# Altium schematic sheet BRAKELED.SchDoc
size A4; SheetNumber: 1; SheetTotal: 1
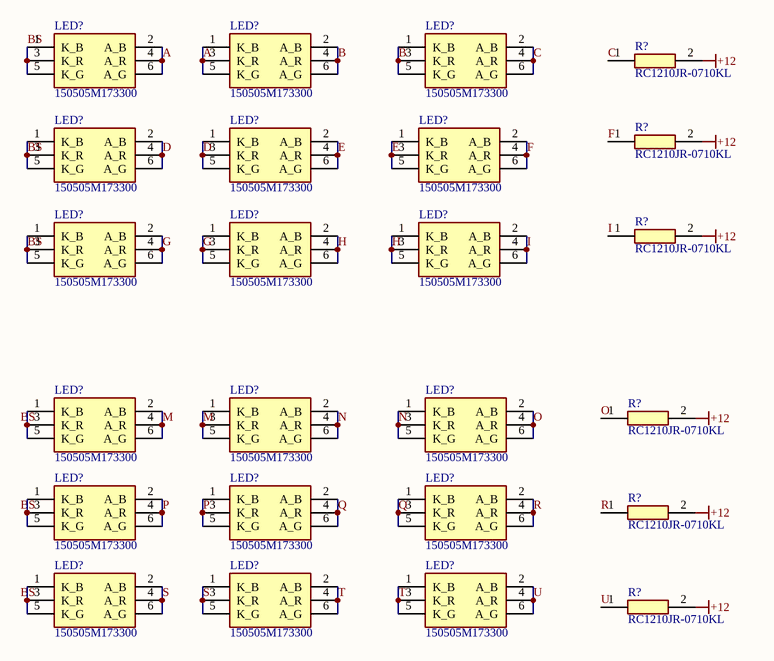
[diagram p0: BRAKELED.SchDoc]

## Parts
(Parts that share a designator on the sheet are numbered #1, #2 ... from top to bottom, then left to right.)
LED?#1  150505M173300  [150505M173300]
LED?#2  150505M173300  [150505M173300]
LED?#3  150505M173300  [150505M173300]
LED?#4  150505M173300  [150505M173300]
LED?#5  150505M173300  [150505M173300]
LED?#6  150505M173300  [150505M173300]
LED?#7  150505M173300  [150505M173300]
LED?#8  150505M173300  [150505M173300]
LED?#9  150505M173300  [150505M173300]
LED?#10  150505M173300  [150505M173300]
LED?#11  150505M173300  [150505M173300]
LED?#12  150505M173300  [150505M173300]
LED?#13  150505M173300  [150505M173300]
LED?#14  150505M173300  [150505M173300]
LED?#15  150505M173300  [150505M173300]
LED?#16  150505M173300  [150505M173300]
LED?#17  150505M173300  [150505M173300]
LED?#18  150505M173300  [150505M173300]
R?#1  RC1210JR-0710KL  [RESC3126X60N]
R?#2  RC1210JR-0710KL  [RESC3126X60N]
R?#3  RC1210JR-0710KL  [RESC3126X60N]
R?#4  RC1210JR-0710KL  [RESC3126X60N]
R?#5  RC1210JR-0710KL  [RESC3126X60N]
R?#6  RC1210JR-0710KL  [RESC3126X60N]

## Nets
+12: R?#1.2 R?#2.2 R?#3.2 R?#4.2 R?#5.2 R?#6.2
A: LED?#1.2(A_B) LED?#1.4(A_R) LED?#1.6(A_G) LED?#2.1(K_B) LED?#2.3(K_R) LED?#2.5(K_G)
B: LED?#2.2(A_B) LED?#2.4(A_R) LED?#2.6(A_G) LED?#3.1(K_B) LED?#3.3(K_R) LED?#3.5(K_G)
BS: LED?#1.1(K_B) LED?#1.3(K_R) LED?#1.5(K_G) LED?#4.1(K_B) LED?#4.3(K_R) LED?#4.5(K_G) LED?#7.1(K_B) LED?#7.3(K_R) LED?#7.5(K_G)
C: LED?#3.2(A_B) LED?#3.4(A_R) LED?#3.6(A_G) R?#1.1
D: LED?#4.2(A_B) LED?#4.4(A_R) LED?#4.6(A_G) LED?#5.1(K_B) LED?#5.3(K_R) LED?#5.5(K_G)
E: LED?#5.2(A_B) LED?#5.4(A_R) LED?#5.6(A_G) LED?#6.1(K_B) LED?#6.3(K_R) LED?#6.5(K_G)
F: LED?#6.2(A_B) LED?#6.4(A_R) LED?#6.6(A_G) R?#2.1
G: LED?#7.2(A_B) LED?#7.4(A_R) LED?#7.6(A_G) LED?#8.1(K_B) LED?#8.3(K_R) LED?#8.5(K_G)
H: LED?#8.2(A_B) LED?#8.4(A_R) LED?#8.6(A_G) LED?#9.1(K_B) LED?#9.3(K_R) LED?#9.5(K_G)
I: LED?#9.2(A_B) LED?#9.4(A_R) LED?#9.6(A_G) R?#3.1
M: LED?#10.2(A_B) LED?#10.4(A_R) LED?#10.6(A_G) LED?#11.1(K_B) LED?#11.3(K_R) LED?#11.5(K_G)
N: LED?#11.2(A_B) LED?#11.4(A_R) LED?#11.6(A_G) LED?#12.1(K_B) LED?#12.3(K_R) LED?#12.5(K_G)
O: LED?#12.2(A_B) LED?#12.4(A_R) LED?#12.6(A_G) R?#4.1
P: LED?#13.2(A_B) LED?#13.4(A_R) LED?#13.6(A_G) LED?#14.1(K_B) LED?#14.3(K_R) LED?#14.5(K_G)
Q: LED?#14.2(A_B) LED?#14.4(A_R) LED?#14.6(A_G) LED?#15.1(K_B) LED?#15.3(K_R) LED?#15.5(K_G)
R: LED?#15.2(A_B) LED?#15.4(A_R) LED?#15.6(A_G) R?#5.1
S: LED?#16.2(A_B) LED?#16.4(A_R) LED?#16.6(A_G) LED?#17.1(K_B) LED?#17.3(K_R) LED?#17.5(K_G)
T: LED?#17.2(A_B) LED?#17.4(A_R) LED?#17.6(A_G) LED?#18.1(K_B) LED?#18.3(K_R) LED?#18.5(K_G)
U: LED?#18.2(A_B) LED?#18.4(A_R) LED?#18.6(A_G) R?#6.1
NetLED?#10_1: LED?#10.1(K_B) LED?#10.3(K_R) LED?#10.5(K_G)
NetLED?#13_1: LED?#13.1(K_B) LED?#13.3(K_R) LED?#13.5(K_G)
NetLED?#16_1: LED?#16.1(K_B) LED?#16.3(K_R) LED?#16.5(K_G)

## Notes on the sheet
- Labels drawn without touching a wire or pin: BS

## Library data of the parts
LED?#1-LED?#18 = 150505M173300: LED; Manufacturer_Name: Wurth Elektronik; Height: 1.8mm; Manufacturer_Part_Number: 150505M173300
  LED?#1-LED?#3 LED?#10-LED?#18: Datasheet Link: https://componentsearchengine.com//150505M173300.pdf; Mouser2 Part Number: 710-150505M173300; Mouser2 Price/Stock: https://www.mouser.com/Search/Refine.aspx?Keyword=710-150505M173300
  LED?#4-LED?#9: Datasheet Link: https://katalog.we-online.de/led/datasheet/150505M173300.pdf; Mouser Part Number: 710-150505M173300; Mouser Price/Stock: https://www.mouser.co.uk/ProductDetail/Wurth-Elektronik/150505M173300?qs=fAHHVMwC%252Bbi%2FURn4Qu0%2FAA%3D%3D
R?#1 R?#4-R?#6 = RC1210JR-0710KL: Resistor; Manufacturer_Name: YAGEO (PHYCOMP); Datasheet Link: http://www.yageo.com/documents/recent/PYu-RC1210_51_RoHS_L_(4).pdf; Height: 0.6mm; Manufacturer_Part_Number: RC1210JR-0710KL; Mouser Part Number: 603-RC1210JR-0710KL; Mouser Price/Stock: https://www.mouser.co.uk/ProductDetail/Yageo/RC1210JR-0710KL?qs=6sj9KdP9svgfoubno5Jb%252BA%3D%3D; Arrow Part Number: RC1210JR-0710KL; Arrow Price/Stock: https://www.arrow.com/en/products/rc1210jr-0710kl/yageo
R?#2 R?#3 = RC1210JR-0710KL: Resistor; Manufacturer_Name: KEMET; Datasheet Link: https://datasheet.datasheetarchive.com/originals/distributors/Datasheets_SAMA/902f9e387b938f871d31120f5fc1d65e.pdf; Height: 0.6mm; Manufacturer_Part_Number: RC1210JR-0710KL; Mouser Part Number: 603-RC1210JR-0710KL; Mouser Price/Stock: https://www.mouser.co.uk/ProductDetail/YAGEO/RC1210JR-0710KL?qs=6sj9KdP9svgfoubno5Jb%252BA%3D%3D; Arrow Part Number: RC1210JR-0710KL; Arrow Price/Stock: https://www.arrow.com/en/products/rc1210jr-0710kl/yageo